# Altium schematic sheet PROB_S7CAS_DAC.SchDoc
size Tabloid; SheetNumber: 12; SheetTotal: 15; Sheet_Name: Convertisseur Numérique à Analogique; Size: 11x17
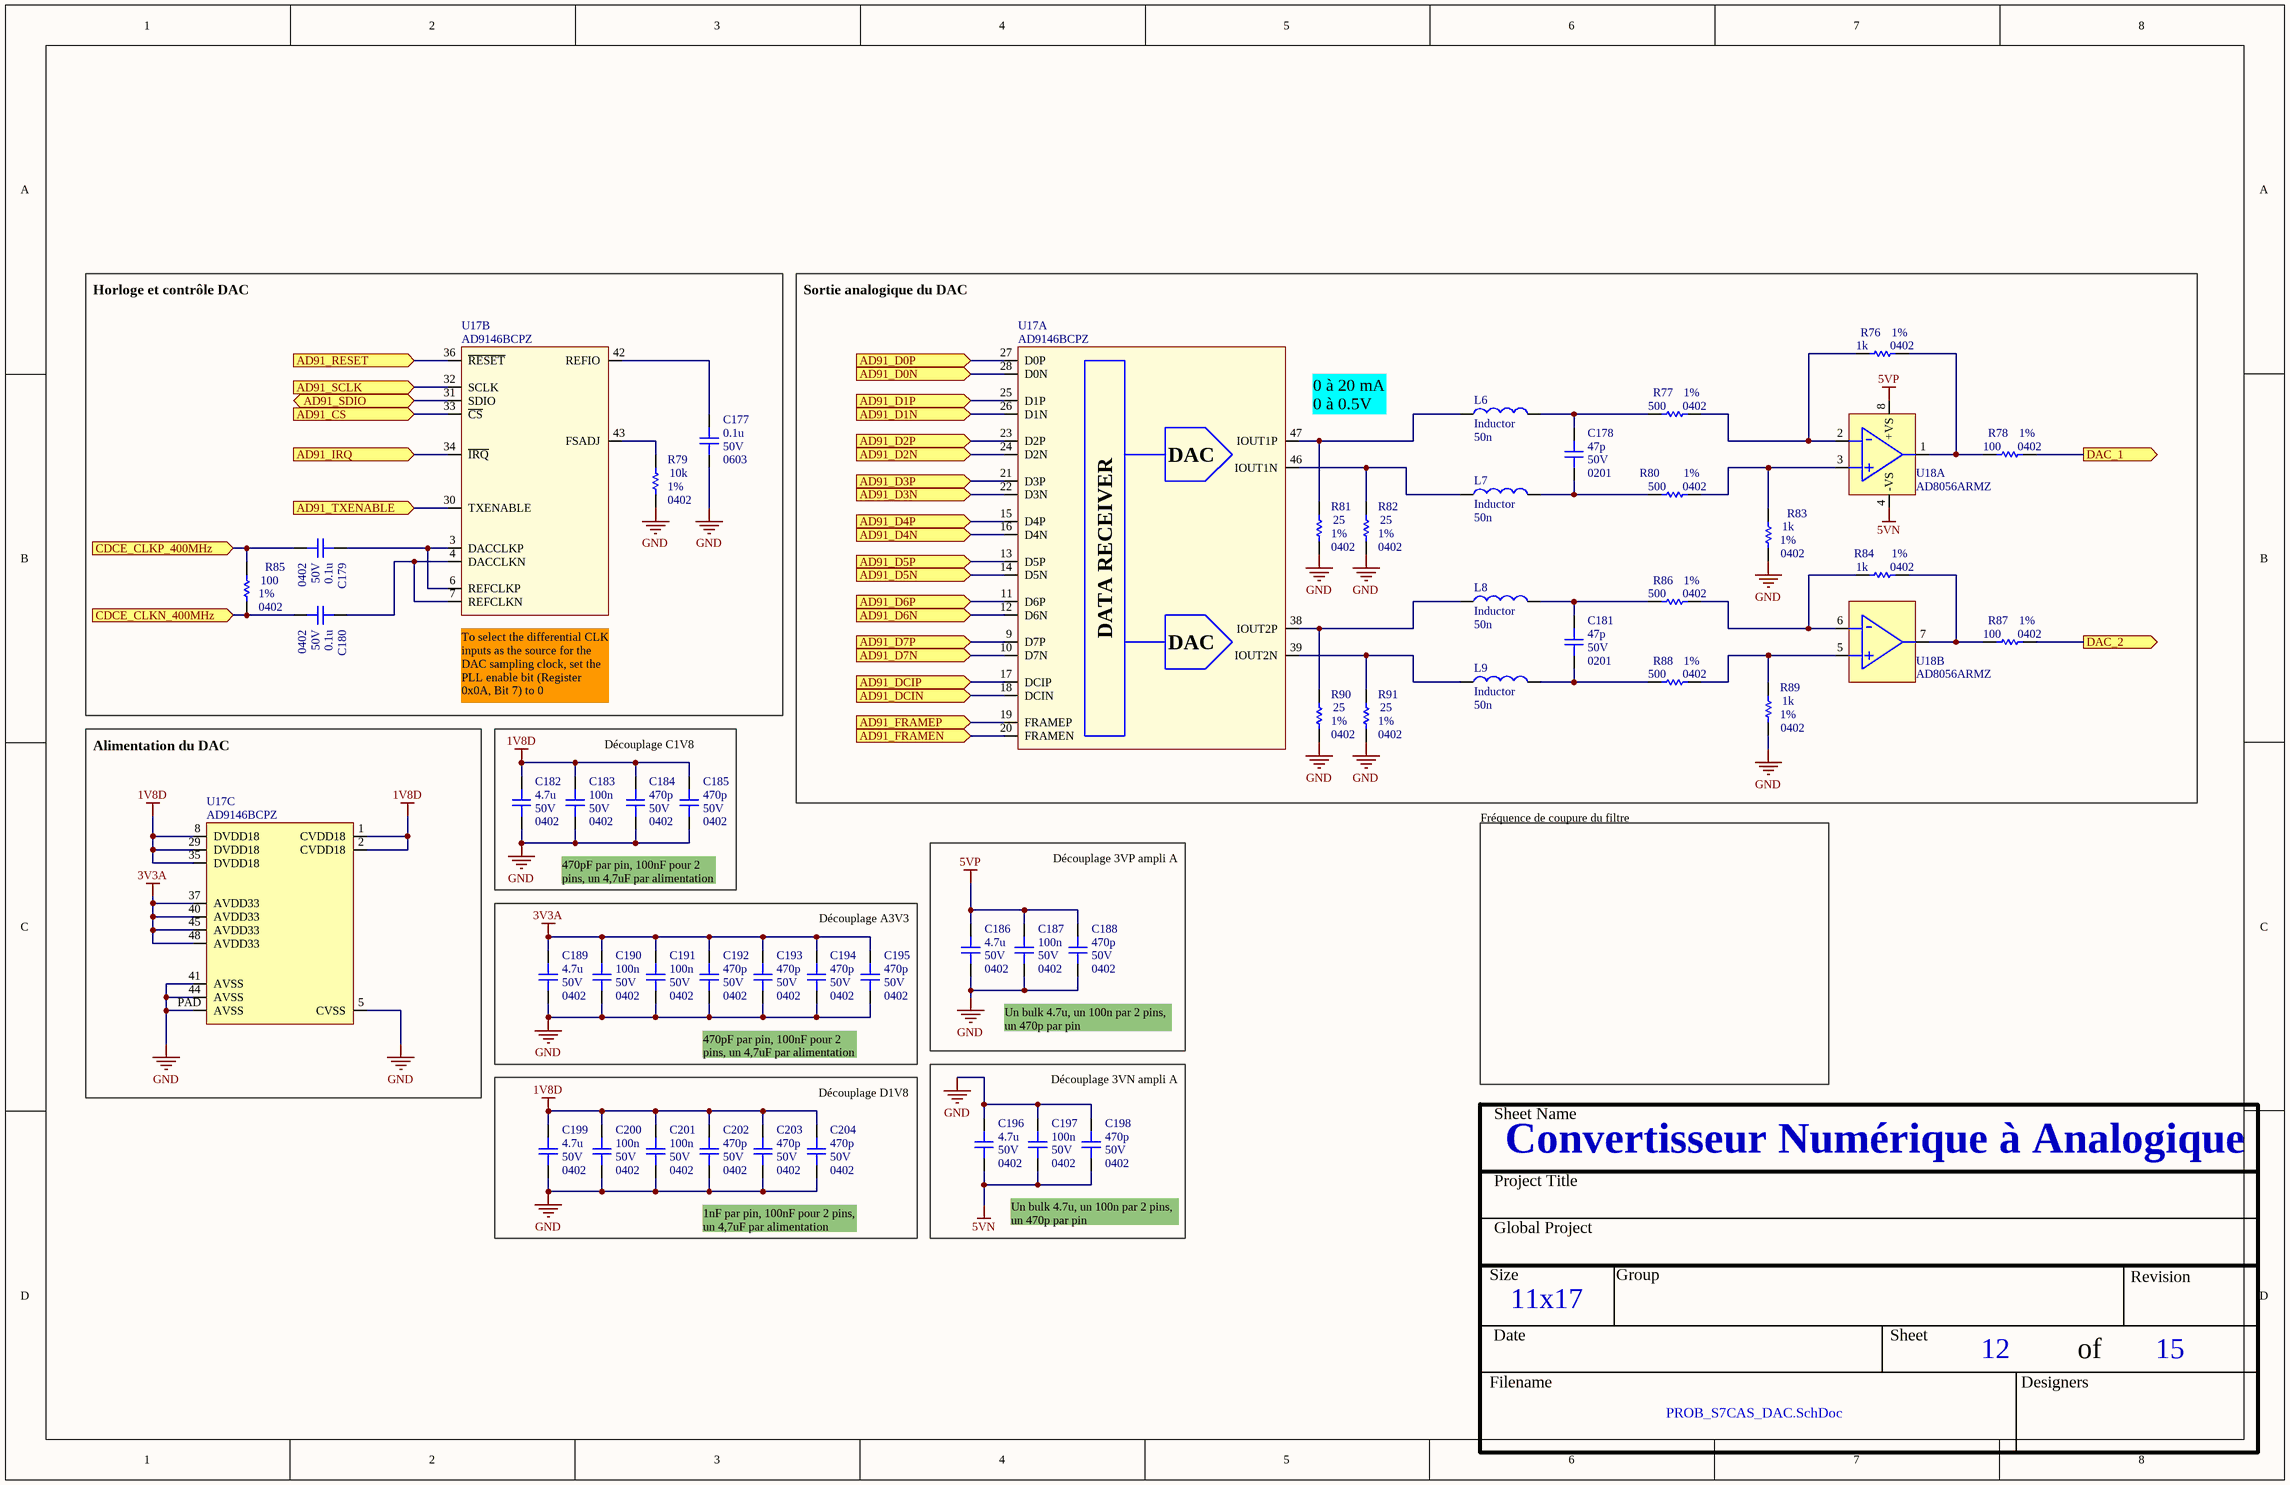
[diagram p0: PROB_S7CAS_DAC.SchDoc]

## Parts
C177  value 0.1u  Voltage: 50V  Package: 0603  [CAP_0603]  (hidden comment: CAP - 0603)
C178  value 47p  Voltage: 50V  Package: 0201  [CAP_0201]  (hidden comment: CAP - 0201)
C179  value 0.1u  Voltage: 50V  Package: 0402  [CAP_0402]  (hidden comment: CAP - 0402)
C180  value 0.1u  Voltage: 50V  Package: 0402  [CAP_0402]  (hidden comment: CAP - 0402)
C181  value 47p  Voltage: 50V  Package: 0201  [CAP_0201]  (hidden comment: CAP - 0201)
C182  value 4.7u  Voltage: 50V  Package: 0402  [CAP_0402]  (hidden comment: CAP - 0402)
C183  value 100n  Voltage: 50V  Package: 0402  [CAP_0402]  (hidden comment: CAP - 0402)
C184  value 470p  Voltage: 50V  Package: 0402  [CAP_0402]  (hidden comment: CAP - 0402)
C185  value 470p  Voltage: 50V  Package: 0402  [CAP_0402]  (hidden comment: CAP - 0402)
C186  value 4.7u  Voltage: 50V  Package: 0402  [CAP_0402]  (hidden comment: CAP - 0402)
C187  value 100n  Voltage: 50V  Package: 0402  [CAP_0402]  (hidden comment: CAP - 0402)
C188  value 470p  Voltage: 50V  Package: 0402  [CAP_0402]  (hidden comment: CAP - 0402)
C189  value 4.7u  Voltage: 50V  Package: 0402  [CAP_0402]  (hidden comment: CAP - 0402)
C190  value 100n  Voltage: 50V  Package: 0402  [CAP_0402]  (hidden comment: CAP - 0402)
C191  value 100n  Voltage: 50V  Package: 0402  [CAP_0402]  (hidden comment: CAP - 0402)
C192  value 470p  Voltage: 50V  Package: 0402  [CAP_0402]  (hidden comment: CAP - 0402)
C193  value 470p  Voltage: 50V  Package: 0402  [CAP_0402]  (hidden comment: CAP - 0402)
C194  value 470p  Voltage: 50V  Package: 0402  [CAP_0402]  (hidden comment: CAP - 0402)
C195  value 470p  Voltage: 50V  Package: 0402  [CAP_0402]  (hidden comment: CAP - 0402)
C196  value 4.7u  Voltage: 50V  Package: 0402  [CAP_0402]  (hidden comment: CAP - 0402)
C197  value 100n  Voltage: 50V  Package: 0402  [CAP_0402]  (hidden comment: CAP - 0402)
C198  value 470p  Voltage: 50V  Package: 0402  [CAP_0402]  (hidden comment: CAP - 0402)
C199  value 4.7u  Voltage: 50V  Package: 0402  [CAP_0402]  (hidden comment: CAP - 0402)
C200  value 100n  Voltage: 50V  Package: 0402  [CAP_0402]  (hidden comment: CAP - 0402)
C201  value 100n  Voltage: 50V  Package: 0402  [CAP_0402]  (hidden comment: CAP - 0402)
C202  value 470p  Voltage: 50V  Package: 0402  [CAP_0402]  (hidden comment: CAP - 0402)
C203  value 470p  Voltage: 50V  Package: 0402  [CAP_0402]  (hidden comment: CAP - 0402)
C204  value 470p  Voltage: 50V  Package: 0402  [CAP_0402]  (hidden comment: CAP - 0402)
L6  Inductor  value 50n  [INDM5250X66N]
L7  Inductor  value 50n  [INDM5250X66N]
L8  Inductor  value 50n  [INDM5250X66N]
L9  Inductor  value 50n  [INDM5250X66N]
R76  value 1k  Package: 0402  Precision: 1%  [RES_0402]  (hidden comment: RES - 0402)
R77  value 500  Package: 0402  Precision: 1%  [RES_0402]  (hidden comment: RES - 0402)
R78  value 100  Package: 0402  Precision: 1%  [RES_0402]  (hidden comment: RES - 0402)
R79  value 10k  Package: 0402  Precision: 1%  [RES_0402]  (hidden comment: RES - 0402)
R80  value 500  Package: 0402  Precision: 1%  [RES_0402]  (hidden comment: RES - 0402)
R81  value 25  Package: 0402  Precision: 1%  [RES_0402]  (hidden comment: RES - 0402)
R82  value 25  Package: 0402  Precision: 1%  [RES_0402]  (hidden comment: RES - 0402)
R83  value 1k  Package: 0402  Precision: 1%  [RES_0402]  (hidden comment: RES - 0402)
R84  value 1k  Package: 0402  Precision: 1%  [RES_0402]  (hidden comment: RES - 0402)
R85  value 100  Package: 0402  Precision: 1%  [RES_0402]  (hidden comment: RES - 0402)
R86  value 500  Package: 0402  Precision: 1%  [RES_0402]  (hidden comment: RES - 0402)
R87  value 100  Package: 0402  Precision: 1%  [RES_0402]  (hidden comment: RES - 0402)
R88  value 500  Package: 0402  Precision: 1%  [RES_0402]  (hidden comment: RES - 0402)
R89  value 1k  Package: 0402  Precision: 1%  [RES_0402]  (hidden comment: RES - 0402)
R90  value 25  Package: 0402  Precision: 1%  [RES_0402]  (hidden comment: RES - 0402)
R91  value 25  Package: 0402  Precision: 1%  [RES_0402]  (hidden comment: RES - 0402)
U17  AD9146BCPZ  [DAC_AD9146BCPZ]  (parts A,B,C of 3)
U18  AD8056ARMZ  [OPAMP_AD8056ARMZ]  (parts A,B of 2)

## Ports
AD91_CS (in), AD91_D0N (in), AD91_D0P (in), AD91_D1N (in), AD91_D1P (in), AD91_D2N (in), AD91_D2P (in), AD91_D3N (in), AD91_D3P (in), AD91_D4N (in), AD91_D4P (in), AD91_D5N (in), AD91_D5P (in), AD91_D6N (in), AD91_D6P (in), AD91_D7N (in), AD91_D7P (in), AD91_DCIN (in), AD91_DCIP (in), AD91_FRAMEN (in), AD91_FRAMEP (in), AD91_IRQ (in), AD91_RESET (in), AD91_SCLK (in), AD91_SDIO (bidir), AD91_TXENABLE (in), CDCE_CLKN_400MHz (in), CDCE_CLKP_400MHz (in), DAC_1 (out), DAC_2 (out)

## Nets
1V8D: C182.2 C183.2 C184.2 C185.2 C199.2 C200.2 C201.2 C202.2 C203.2 C204.2 U17.1(CVDD18) U17.2(CVDD18) U17.8(DVDD18) U17.29(DVDD18) U17.35(DVDD18)
3V3A: C189.2 C190.2 C191.2 C192.2 C193.2 C194.2 C195.2 U17.37(AVDD33) U17.40(AVDD33) U17.45(AVDD33) U17.48(AVDD33)
5VN: C196.1 C197.1 C198.1 U18.4(-VS)
5VP: C186.2 C187.2 C188.2 U18.8(+VS)
GND: C177.1 C182.1 C183.1 C184.1 C185.1 C186.1 C187.1 C188.1 C189.1 C190.1 C191.1 C192.1 C193.1 C194.1 C195.1 C196.2 C197.2 C198.2 C199.1 C200.1 C201.1 C202.1 C203.1 C204.1 R79.1 R81.1 R82.1 R83.1 R89.1 R90.1 R91.1 U17.5(CVSS) U17.41(AVSS) U17.44(AVSS) U17.PAD(AVSS)
AD91_CS: U17.33(~{CS}) ; port AD91_CS
AD91_D0N: U17.28(D0N) ; port AD91_D0N
AD91_D0P: U17.27(D0P) ; port AD91_D0P
AD91_D1N: U17.26(D1N) ; port AD91_D1N
AD91_D1P: U17.25(D1P) ; port AD91_D1P
AD91_D2N: U17.24(D2N) ; port AD91_D2N
AD91_D2P: U17.23(D2P) ; port AD91_D2P
AD91_D3N: U17.22(D3N) ; port AD91_D3N
AD91_D3P: U17.21(D3P) ; port AD91_D3P
AD91_D4N: U17.16(D4N) ; port AD91_D4N
AD91_D4P: U17.15(D4P) ; port AD91_D4P
AD91_D5N: U17.14(D5N) ; port AD91_D5N
AD91_D5P: U17.13(D5P) ; port AD91_D5P
AD91_D6N: U17.12(D6N) ; port AD91_D6N
AD91_D6P: U17.11(D6P) ; port AD91_D6P
AD91_D7N: U17.10(D7N) ; port AD91_D7N
AD91_D7P: U17.9(D7P) ; port AD91_D7P
AD91_DCIN: U17.18(DCIN) ; port AD91_DCIN
AD91_DCIP: U17.17(DCIP) ; port AD91_DCIP
AD91_FRAMEN: U17.20(FRAMEN) ; port AD91_FRAMEN
AD91_FRAMEP: U17.19(FRAMEP) ; port AD91_FRAMEP
AD91_IRQ: U17.34(~{IRQ}) ; port AD91_IRQ
AD91_RESET: U17.36(~{RESET}) ; port AD91_RESET
AD91_SCLK: U17.32(SCLK) ; port AD91_SCLK
AD91_SDIO: U17.31(SDIO) ; port AD91_SDIO
AD91_TXENABLE: U17.30(TXENABLE) ; port AD91_TXENABLE
CDCE_CLKN_400MHz: C180.1 R85.1 ; port CDCE_CLKN_400MHz
CDCE_CLKP_400MHz: C179.1 R85.2 ; port CDCE_CLKP_400MHz
DAC_1: R78.2 ; port DAC_1
DAC_2: R87.2 ; port DAC_2
NetC177_2: C177.2 U17.42(REFIO)
NetC178_1: C178.1 L7.2 R80.1
NetC178_2: C178.2 L6.2 R77.1
NetC179_2: C179.2 U17.3(DACCLKP) U17.6(REFCLKP)
NetC180_2: C180.2 U17.4(DACCLKN) U17.7(REFCLKN)
NetC181_1: C181.1 L9.2 R88.1
NetC181_2: C181.2 L8.2 R86.1
NetL6_1: L6.1 R81.2 U17.47(IOUT1P)
NetL7_1: L7.1 R82.2 U17.46(IOUT1N)
NetL8_1: L8.1 R90.2 U17.38(IOUT2P)
NetL9_1: L9.1 R91.2 U17.39(IOUT2N)
NetR76_1: R76.1 R77.2 U18.2(-IN1)
NetR76_2: R76.2 R78.1 U18.1(OUT1)
NetR79_2: R79.2 U17.43(FSADJ)
NetR80_2: R80.2 R83.2 U18.3(+IN1)
NetR84_1: R84.1 R86.2 U18.6(-IN2)
NetR84_2: R84.2 R87.1 U18.7(OUT2)
NetR88_2: R88.2 R89.2 U18.5(+IN2)

## Notes on the sheet
- Horloge et contrôle DAC
- Sortie analogique du DAC
- (near U17) 0 à 20 mA 0 à 0.5V
- (near U17) To select the differential CLK inputs as the source for the DAC sampling clock, set the PLL enable bit (Register 0x0A, Bit 7) to 0
- Alimentation du DAC
- Découplage C1V8
- Fréquence de coupure du filtre
- 470pF par pin, 100nF pour 2 pins, un 4,7uF par alimentation
- Découplage 3VP ampli A
- Découplage A3V3
- Un bulk 4.7u, un 100n par 2 pins, un 470p par pin
- Découplage D1V8
- Découplage 3VN ampli A
- 1nF par pin, 100nF pour 2 pins, un 4,7uF par alimentation
- Sheet Name
- Project Title
- Global Project
- Size
- Group
- Revision
- Date
- Sheet
- of
- Filename
- Designers
- (in symbol DAC_AD9146BCPZ, part A) DAC; DATA RECEIVER

## Library data of the parts
C177 = CAP - 0603: Precision: 10%; Current: *; CreatedBy: Jonathan Bouchard; Power: *
C178 C181 = CAP - 0201: Precision: 10%; Current: *; CreatedBy: Jonathan Bouchard; Power: *
C179 C180 C182-C204 = CAP - 0402: Precision: 10%; Current: *; CreatedBy: Jonathan Bouchard; Power: *
L6-L9 = Inductor: IND PWR BEAD 50NH 48A SMD; GRAMS Lib Spec: 2.7; HelpURL: https://productfinder.pulseelectronics.com/api/open/part-attachments/datasheet/pa5190.500hlt
R76-R91 = RES - 0402: Voltage: 50V; Power: 1/16W; Current: *; CreatedBy: Jonathan Bouchard
U17 = DAC_AD9146BCPZ: DAC - 16BIT SRL HIGH SPEED - QFN-48; Voltage: 3.13 V ~ 3.47 V / 1.71 V ~ 1.89 V; Mfg: Analog Devices Inc.; Current: *; Power: *; Mfg Part Number: AD9146BCPZ; HelpURL: http://www.analog.com/media/en/technical-documentation/data-sheets/AD9146.PDF; CreatedBy: Jonathan Bouchard; Temperature: -40°C ~ 85°C; Value: *; Precision: 16 Bit; Package: QFN-48; Supplier 1: Digikey; Supplier Part Number 1: AD9146BCPZ-ND
U18 = OPAMP_AD8056ARMZ: OPAMP - VFB 300MHZ - 8MSOP; Voltage: 8 V ~ 12 V, ±4 V ~ 6 V; Current: 60mA; Mfg: Analog Devices; Power: *; Mfg Part Number: AD8056ARMZ; HelpURL: http://www.analog.com/media/en/technical-documentation/data-sheets/AD8055_8056.pdf; CreatedBy: Jonathan Bouchard; Temperature: -40°C ~ 125°C; Value: *; Precision: *; Package: MSOP-8; Supplier 1: Digikey; Supplier Part Number 1: AD8056ARMZ-REEL7CT-ND